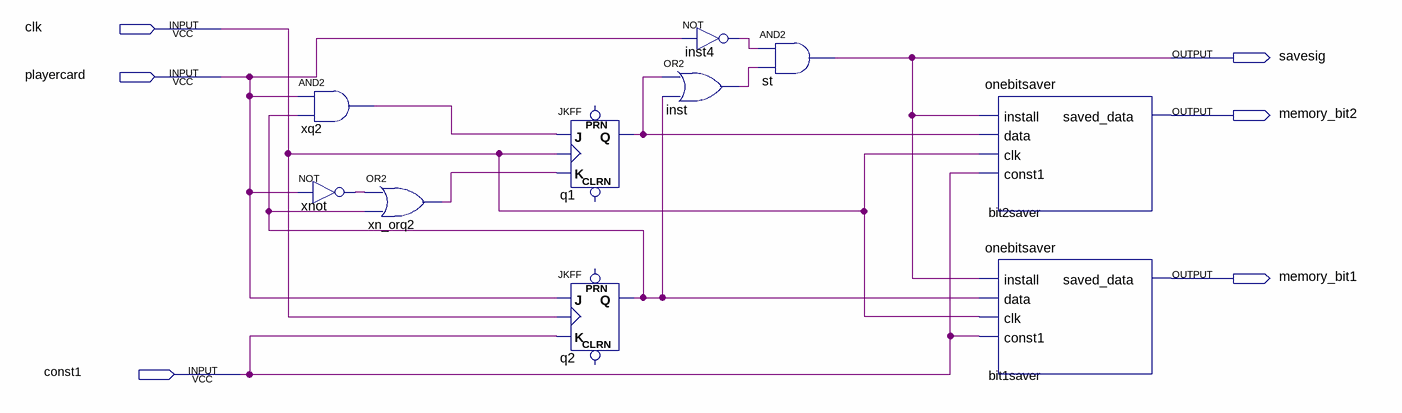
[diagram p0: schematic sheet]
// Quartus schematic cardsaver2.bdf as structural Verilog: 10 symbols, 6 pins
module cardsaver2 (
  input  clk,
  input  playercard,
  input  const1,
  output savesig,
  output memory_bit2,
  output memory_bit1
);

  wire inst4_out, inst_out, q1_q, q2_q, xn_orq2_out, xnot_out, xq2_out;

  and xq2 (xq2_out, playercard, q2_q);
  not xnot (xnot_out, playercard);
  or xn_orq2 (xn_orq2_out, xnot_out, q2_q);
  JKFF q1 (.K(xn_orq2_out), .J(xq2_out), .CLK(clk), .Q(q1_q));  // open: PRN, CLRN
  JKFF q2 (.K(const1), .J(playercard), .CLK(clk), .Q(q2_q));  // open: PRN, CLRN
  not inst4 (inst4_out, playercard);
  or inst (inst_out, q1_q, q2_q);
  and st (savesig, inst4_out, inst_out);
  onebitsaver bit2saver (.install(savesig), .data(q1_q), .clk(clk), .const1(const1), .saved_data(memory_bit2));
  onebitsaver bit1saver (.install(savesig), .data(q2_q), .clk(clk), .const1(const1), .saved_data(memory_bit1));
endmodule
